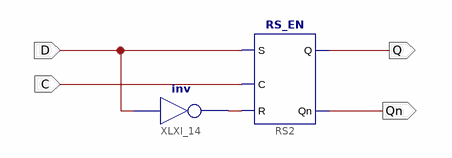
[diagram p0: schematic sheet 1]
// Xilinx ISE schematic D_CN.sch (spartan3) as structural Verilog: 2 symbols, 4 ports
module D_CN (
  input  D,
  input  C,
  output Q,
  output Qn
);

  wire XLXN_44;

  not XLXI_14 (XLXN_44, D);
  RS_EN RS2 (.Q(Q), .Qn(Qn), .C(C), .S(D), .R(XLXN_44));
endmodule
